# EAGLE schematic Beagle Cape (EAGLE 6.3)
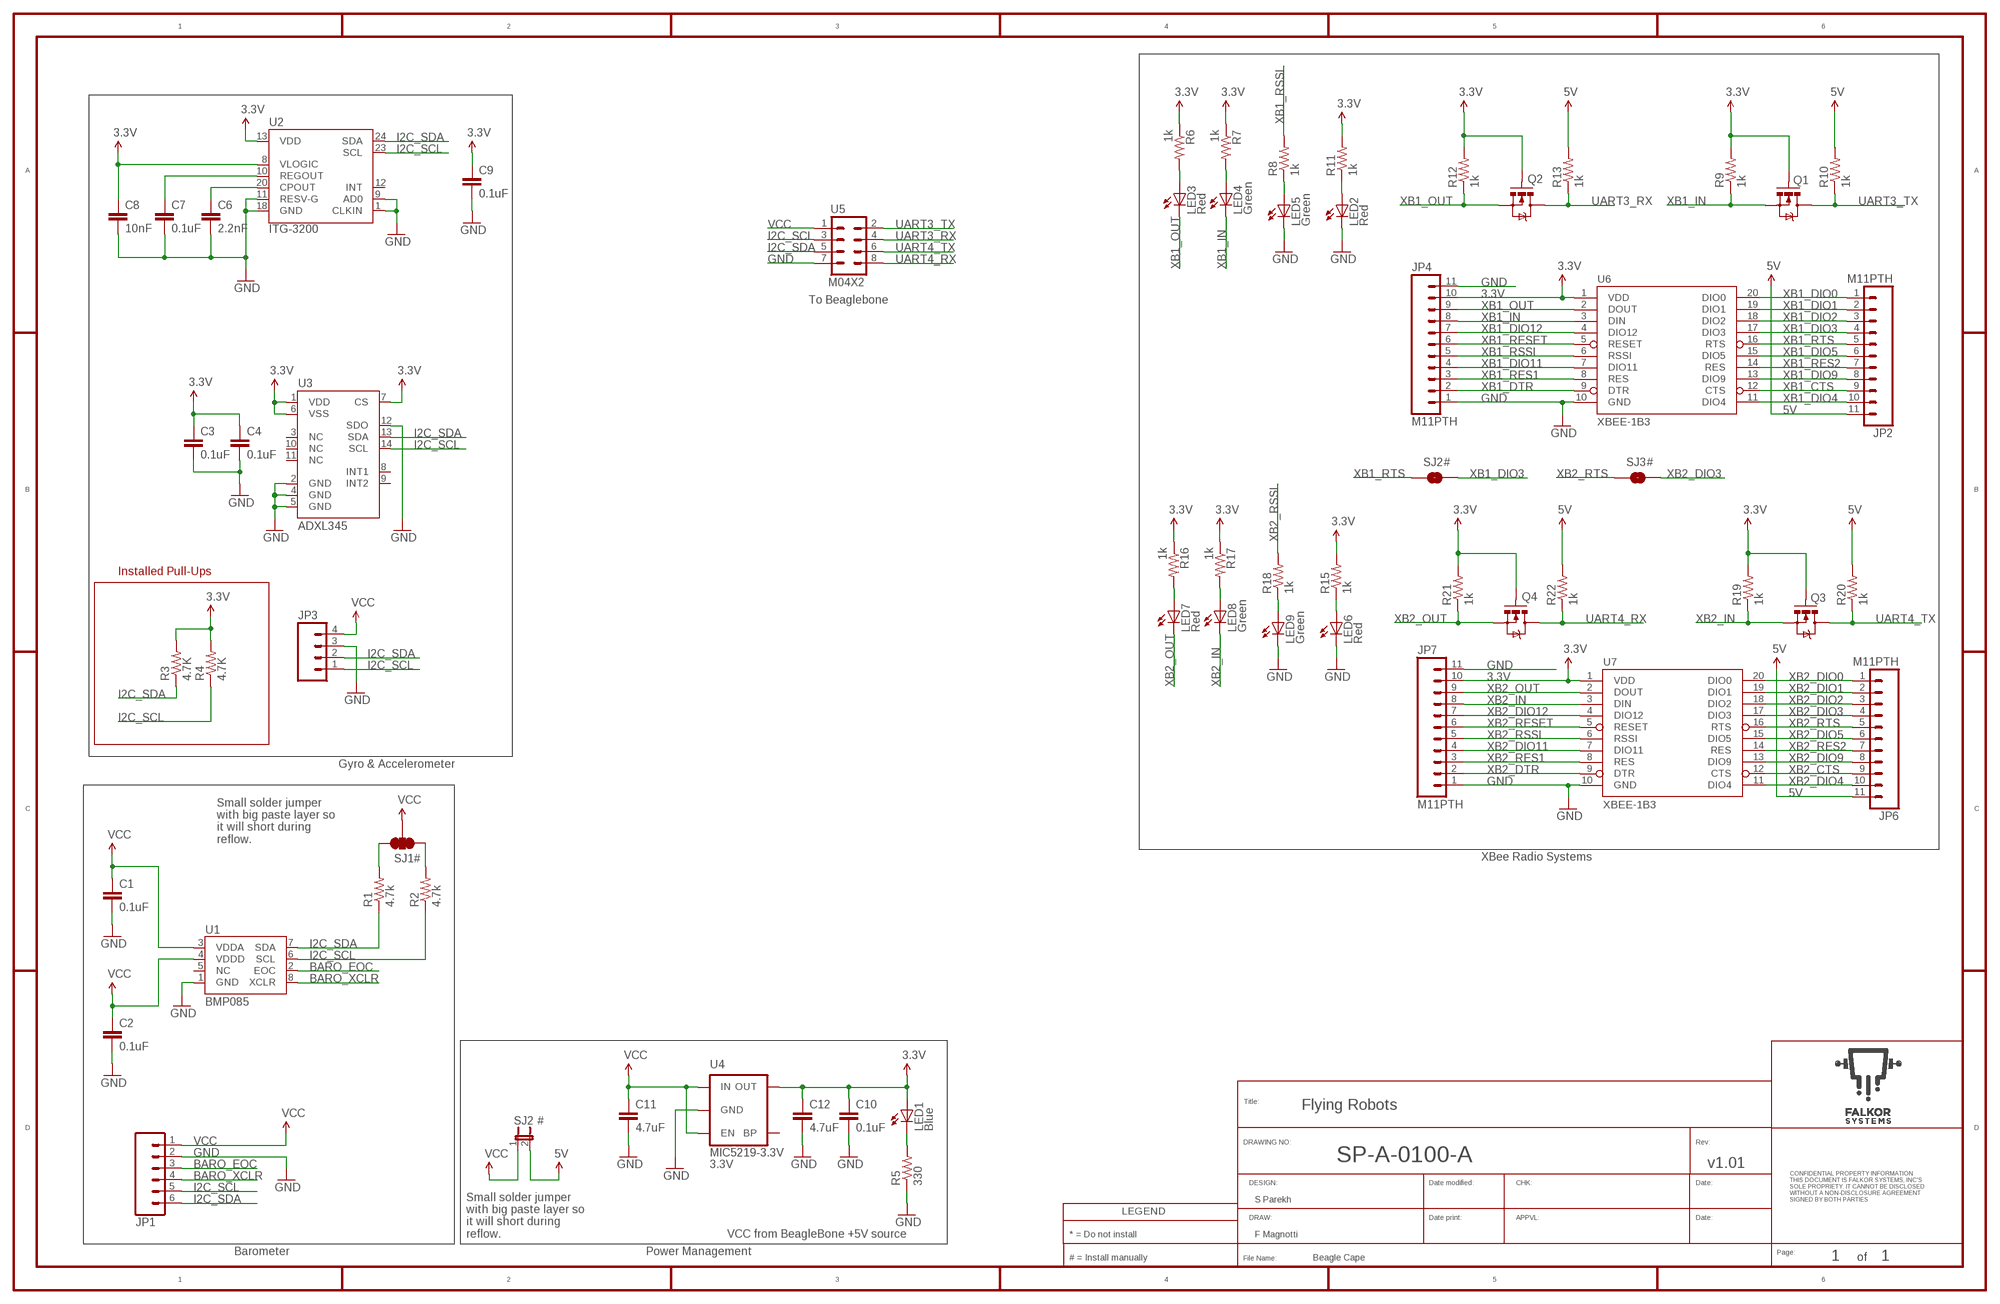
[diagram p0: schematic, sheet 1]

## Parts
C1  0.1uF  CAP0402-CAP  [0402-CAP]
C2  0.1uF  CAP0402-CAP  [0402-CAP]
C3  0.1uF  CAP0402-CAP  [0402-CAP]
C4  0.1uF  CAP0402-CAP  [0402-CAP]
C6  2.2nF  CAP0402-CAP  [0402-CAP]
C7  0.1uF  CAP0402-CAP  [0402-CAP]
C8  10nF  CAP0402-CAP  [0402-CAP]
C9  0.1uF  CAP0402-CAP  [0402-CAP]
C10  0.1uF  CAP0402-CAP  [0402-CAP]
C11  4.7uF  CAP0402-CAP  [0402-CAP]
C12  4.7uF  CAP0402-CAP  [0402-CAP]
JP1  M06SIP  [1X06]
JP2  M11PTH  [1X11]
JP3  M04PTH  [1X04]
JP4  M11PTH  [1X11]
JP6  M11PTH  [1X11]
JP7  M11PTH  [1X11]
LED1  Blue  LED0603  [LED-0603]
LED2  Red  LED0603  [LED-0603]
LED3  Red  LED0603  [LED-0603]
LED4  Green  LED0603  [LED-0603]
LED5  Green  LED0603  [LED-0603]
LED6  Red  LED0603  [LED-0603]
LED7  Red  LED0603  [LED-0603]
LED8  Green  LED0603  [LED-0603]
LED9  Green  LED0603  [LED-0603]
Q1  MOSFET-NCHANNELSMD  [SOT23-3]
Q2  MOSFET-NCHANNELSMD  [SOT23-3]
Q3  MOSFET-NCHANNELSMD  [SOT23-3]
Q4  MOSFET-NCHANNELSMD  [SOT23-3]
R1  4.7k  RESISTOR0402-RES  [0402-RES]
R2  4.7k  RESISTOR0402-RES  [0402-RES]
R3  4.7K  RESISTOR0402-RES  [0402-RES]
R4  4.7K  RESISTOR0402-RES  [0402-RES]
R5  330  RESISTOR0402-RES  [0402-RES]
R6  1k  RESISTOR0402-RES  [0402-RES]
R7  1k  RESISTOR0402-RES  [0402-RES]
R8  1k  RESISTOR0402-RES  [0402-RES]
R9  1k  RESISTOR0402-RES  [0402-RES]
R10  1k  RESISTOR0402-RES  [0402-RES]
R11  1k  RESISTOR0402-RES  [0402-RES]
R12  1k  RESISTOR0402-RES  [0402-RES]
R13  1k  RESISTOR0402-RES  [0402-RES]
R15  1k  RESISTOR0402-RES  [0402-RES]
R16  1k  RESISTOR0402-RES  [0402-RES]
R17  1k  RESISTOR0402-RES  [0402-RES]
R18  1k  RESISTOR0402-RES  [0402-RES]
R19  1k  RESISTOR0402-RES  [0402-RES]
R20  1k  RESISTOR0402-RES  [0402-RES]
R21  1k  RESISTOR0402-RES  [0402-RES]
R22  1k  RESISTOR0402-RES  [0402-RES]
SJ1  SOLDERJUMPER_2WAYPASTE1&2&3  [SJ_3_PASTE1&2&3]
SJ2  JUMPER-2SMD-NC  [SJ_2S]
SJ2#  SOLDERJUMPERNO  [SJ_2S-NO]
SJ3#  SOLDERJUMPERNO  [SJ_2S-NO]
U1  BMP085  [BMP085]
U2  ITG-3200  [QFN-24]
U3  ADXL345  [LGA14]
U4  3.3V  V_REG_LDOSMD  [SOT23-5]
U5  M04X2  [2X4]
U6  XBEE-1B3  [XBEE-SMD]
U7  XBEE-1B3  [XBEE-SMD]

## Nets
3.3V: C3.1 C4.1 C8.1 C9.1 C10.1 C12.1 JP4.10 JP7.10 LED1.A Q1.1(G) Q2.1(G) Q3.1(G) Q4.1(G) R3.2 R4.2 R6.1 R7.1 R9.2 R11.2 R12.2 R15.2 R16.1 R17.1 R19.2 R21.2 U2.8(VLOGIC) U2.13(VDD) U3.1(VDD) U3.6(VSS) U3.7(CS) U4.5(OUT) U6.1(VDD) U7.1(VDD)
5V [vcc]: JP2.11 JP6.11 R10.2 R13.2 R20.2 R22.2 SJ2.2
BARO_EOC: JP1.3 U1.2(EOC)
BARO_XCLR: JP1.4 U1.8(XCLR)
GND: C1.2 C2.2 C3.2 C4.2 C6.2 C7.2 C8.2 C9.2 C10.2 C11.2 C12.2 JP1.2 JP3.3 JP4.1 JP4.11 JP7.1 JP7.11 LED2.C LED5.C LED6.C LED9.C R5.1 U1.1(GND) U2.1(CLKIN) U2.9(AD0) U2.11(RESV-G) U2.18(GND) U3.2(GND) U3.4(GND) U3.5(GND) U3.12(SDO) U4.2(GND) U5.7 U6.10(GND) U7.10(GND)
I2C_SCL: JP1.5 JP3.1 R2.1 R4.1 U1.6(SCL) U2.23(SCL) U3.14(SCL) U5.3
I2C_SDA: JP1.6 JP3.2 R1.1 R3.1 U1.7(SDA) U2.24(SDA) U3.13(SDA) U5.5
N$1: R1.2 SJ1.3
N$2: R2.2 SJ1.1
N$4: LED1.C R5.2
N$5: C6.1 U2.20(CPOUT)
N$7: C7.1 U2.10(REGOUT)
N$9: LED3.A R6.2
N$10: LED4.A R7.2
N$11: LED5.A R8.1
N$12: LED6.A R15.1
N$13: LED7.A R16.2
N$14: LED8.A R17.2
N$15: LED9.A R18.1
N$38: LED2.A R11.1
UART3_RX: Q2.3(D) R13.1 U5.4
UART3_TX: Q1.3(D) R10.1 U5.2
UART4_RX: Q4.3(D) R22.1 U5.8
UART4_TX: Q3.3(D) R20.1 U5.6
VCC: C1.1 C2.1 C11.1 JP1.1 JP3.4 SJ1.2 SJ2.1 U1.3(VDDA) U1.4(VDDD) U4.1(IN) U4.3(EN) U5.1
XB1_CTS: JP2.9 U6.12(CTS)
XB1_DIO0: JP2.1 U6.20(DIO0)
XB1_DIO1: JP2.2 U6.19(DIO1)
XB1_DIO2: JP2.3 U6.18(DIO2)
XB1_DIO3: JP2.4 SJ2#.2 U6.17(DIO3)
XB1_DIO4: JP2.10 U6.11(DIO4)
XB1_DIO5: JP2.6 U6.15(DIO5)
XB1_DIO9: JP2.8 U6.13(DIO9)
XB1_DIO11: JP4.4 U6.7(DIO11)
XB1_DIO12: JP4.7 U6.4(DIO12)
XB1_DTR: JP4.2 U6.9(DTR)
XB1_IN: JP4.8 LED4.C Q1.2(S) R9.1 U6.3(DIN)
XB1_OUT: JP4.9 LED3.C Q2.2(S) R12.1 U6.2(DOUT)
XB1_RES1: JP4.3 U6.8(RES)
XB1_RES2: JP2.7 U6.14(RES)
XB1_RESET: JP4.6 U6.5(RESET)
XB1_RSSI: JP4.5 R8.2 U6.6(RSSI)
XB1_RTS: JP2.5 SJ2#.1 U6.16(RTS)
XB2_CTS: JP6.9 U7.12(CTS)
XB2_DIO0: JP6.1 U7.20(DIO0)
XB2_DIO1: JP6.2 U7.19(DIO1)
XB2_DIO2: JP6.3 U7.18(DIO2)
XB2_DIO3: JP6.4 SJ3#.2 U7.17(DIO3)
XB2_DIO4: JP6.10 U7.11(DIO4)
XB2_DIO5: JP6.6 U7.15(DIO5)
XB2_DIO9: JP6.8 U7.13(DIO9)
XB2_DIO11: JP7.4 U7.7(DIO11)
XB2_DIO12: JP7.7 U7.4(DIO12)
XB2_DTR: JP7.2 U7.9(DTR)
XB2_IN: JP7.8 LED8.C Q3.2(S) R19.1 U7.3(DIN)
XB2_OUT: JP7.9 LED7.C Q4.2(S) R21.1 U7.2(DOUT)
XB2_RES1: JP7.3 U7.8(RES)
XB2_RES2: JP6.7 U7.14(RES)
XB2_RESET: JP7.6 U7.5(RESET)
XB2_RSSI: JP7.5 R18.2 U7.6(RSSI)
XB2_RTS: JP6.5 SJ3#.1 U7.16(RTS)
Unconnected: U1.5(NC) U2.12(INT) U3.3(NC) U3.8(INT1) U3.9(INT2) U3.10(NC) U3.11(NC) U4.4(BP)

## Notes on the sheet
- To Beaglebone
- Installed Pull-Ups
- Gyro & Accelerometer
- Small solder jumper 
  with big paste layer so 
  it will short during 
  reflow.
- # | XBee Radio Systems
- Title:
- Flying Robots
- #
- DRAWING NO: | Rev:
- MIC5219-3.3V
- SP-A-0100-A
- v1.01
- DESIGN: | Date modified: | CHK: | Date:
- CONFIDENTIAL PROPERTY INFORMATION
  THIS DOCUMENT IS FALKOR SYSTEMS, INC'S
  SOLE PROPRIETY. IT CANNOT BE DISCLOSED
  WITHOUT A NON-DISCLOSURE AGREEMENT
  SIGNED BY BOTH PARTIES
- S Parekh
- LEGEND
- DRAW: | Date print: | APPVL: | Date:
- Small solder jumper 
  with big paste layer so 
  it will short during 
  reflow.
- VCC from BeagleBone +5V source | * = Do not install | F Magnotti
- Barometer | Power Management | Page:
- # = Install manually | File Name: | of

## Library data of the parts
C1-C4 C6-C12 = SparkFun:CAP: Capacitor Standard 0603 ceramic capacitor, and 0.1" leaded capacitor.
JP1 = SparkFun:M06: Header 6 Standard 6-pin 0.1" header. Use with straight break away headers (SKU : PRT-00116), right angle break away headers (PRT-00553), swiss pins (PRT-00743), machine pins (PRT-00117), and female headers (PRT-00115). Molex polarized connector foot print use with SKU : PRT-08094 with associated crimp pins and housings. NOTES ON THE VARIANTS LOCK and LOCK_LONGPADS... This footprint was designed to help hold the alignment of a through-hole component (i.e. 6-pin header) while soldering it into place. You may notice that each hole has been shifted either up or down by 0.005 of an inch from it's more standard position (which is a perfectly straight line). This slight alteration caused the pins (the squares in the middle) to touch the edges of the holes. Because they are alternating, it causes a "brace" to hold the component in place. 0.005 has proven to be the perfect amount of "off-center" position when using our standard breakaway headers. Although looks a little odd when you look at the bare footprint, once you have a header in there, the alteration is very hard to notice. Also, if you push a header all the way into place, it is covered up entirely on the bottom side. This idea of altering the position of holes to aid alignment will be further integrated into the Sparkfun Library for other footprints. It can help hold any component with 3 or more connection pins.
JP2 JP4 JP6 JP7 = SparkFun:M11: Header 11 Standard 11-pin 0.1" header. Use with straight break away headers (SKU : PRT-00116), right angle break away headers (PRT-00553), swiss pins (PRT-00743), machine pins (PRT-00117), and female headers (PRT-00115).
JP3 = SparkFun:M04: Header 4 Standard 4-pin 0.1" header. Use with straight break away headers (SKU : PRT-00116), right angle break away headers (PRT-00553), swiss pins (PRT-00743), machine pins (PRT-00117), and female headers (PRT-00115). Molex polarized connector foot print use with SKU : PRT-08231 with associated crimp pins and housings.
LED1-LED9 = SparkFun:LED: LEDs Standard schematic elements and footprints for 5mm, 3mm, 1206, and 0603 sized LEDs. 5mm - Spark Fun Electronics SKU : COM-00529 (and others)
Q1-Q4 = SparkFun-DiscreteSemi:MOSFET-NCHANNEL: Generic NMOS footprint
R1-R13 R15-R22 = SparkFun:RESISTOR: Resistor Basic schematic elements and footprints for 0603, 1206, and PTH resistors.
SJ1 = mike-temp:SOLDERJUMPER_2WAY: Solder Jumper 2 way solder jumper
SJ2 = FAM_Library:JUMPER-2
SJ2# SJ3# = SparkFun:SOLDERJUMPER: Solder Jumper Standard SMD solder jumper. Used to automate production. Two varients : Normally Open and Normally Closed are the same, but have different paste layers. NC will have a large amount of paste and should jumper during reflow.
U1 = SparkFun:BMP085: BMP085 Pressure Sensor Great little MEMS pressure sensor. SKU: COM-09603
U2 = SparkFun:ITG-3200: ITG-3200 3-axis gyro, digital output, qfn24 package
U3 = SparkFun:ADXL345
U4 = SparkFun:V_REG_LDO: Voltage Regulator LDO Standard 150mA LDO voltage regulator in SOT-23 layout. Micrel part MIC5205. BP (by-pass) pin is used to lower output noise with 470pF cap.
U5 = SparkFun:M04X2
U6 U7 = SparkFun:XBEE-1

## Net classes
1 vcc: width 0.305 mm